# Altium schematic sheet 06-BatteryManagement.SchDoc: Battery Management
size A2; DocumentNumber: 6; SheetNumber: 6; SheetTotal: 15
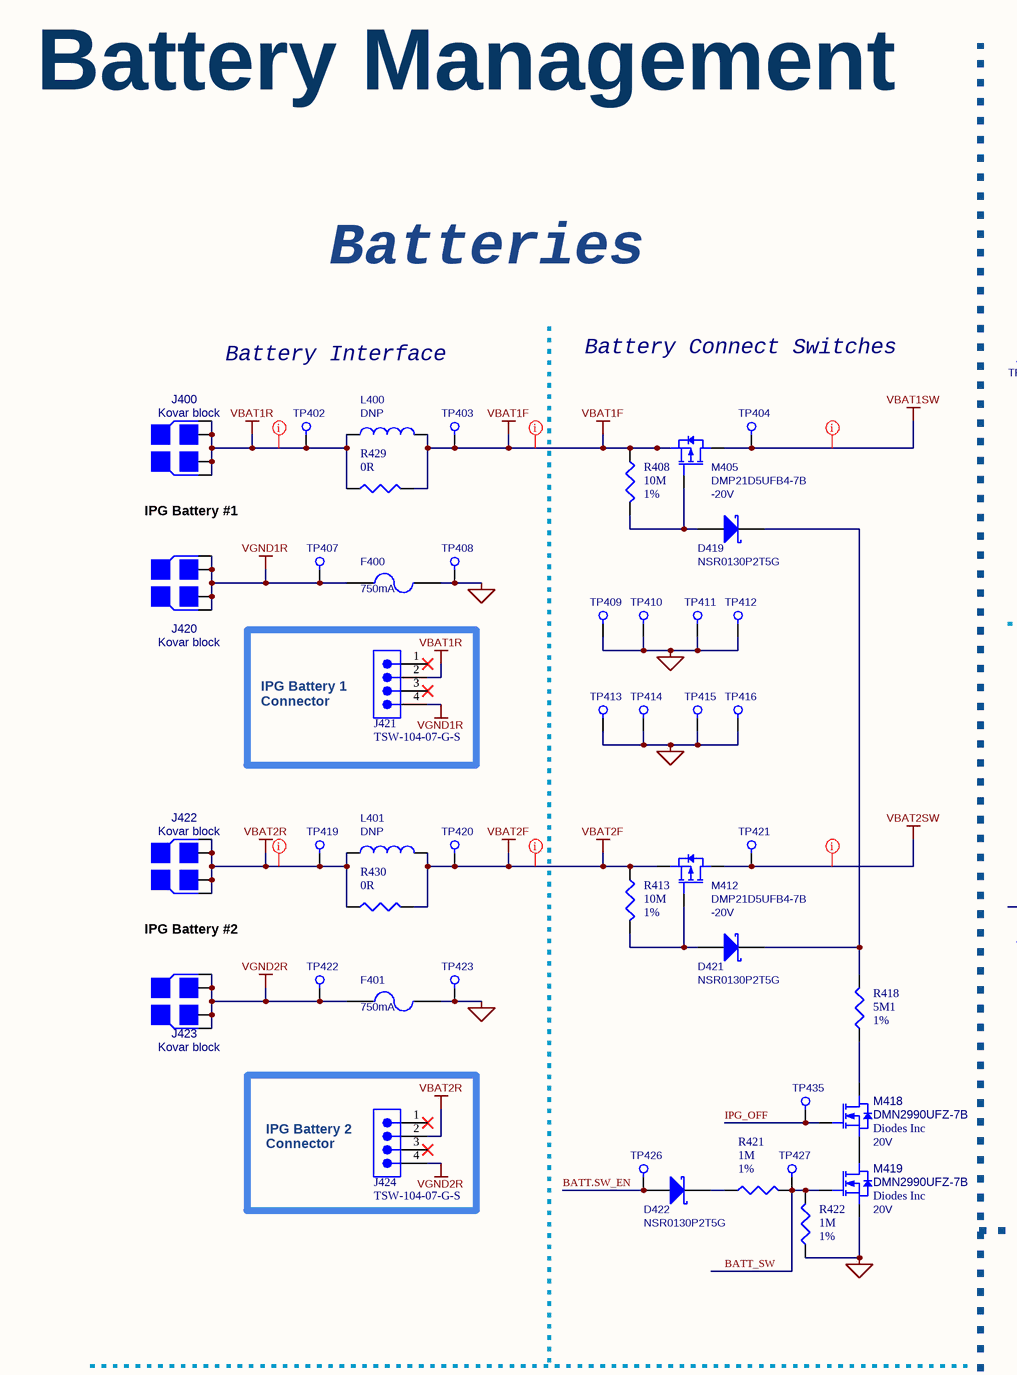
[diagram p0: 06-BatteryManagement.SchDoc, left]
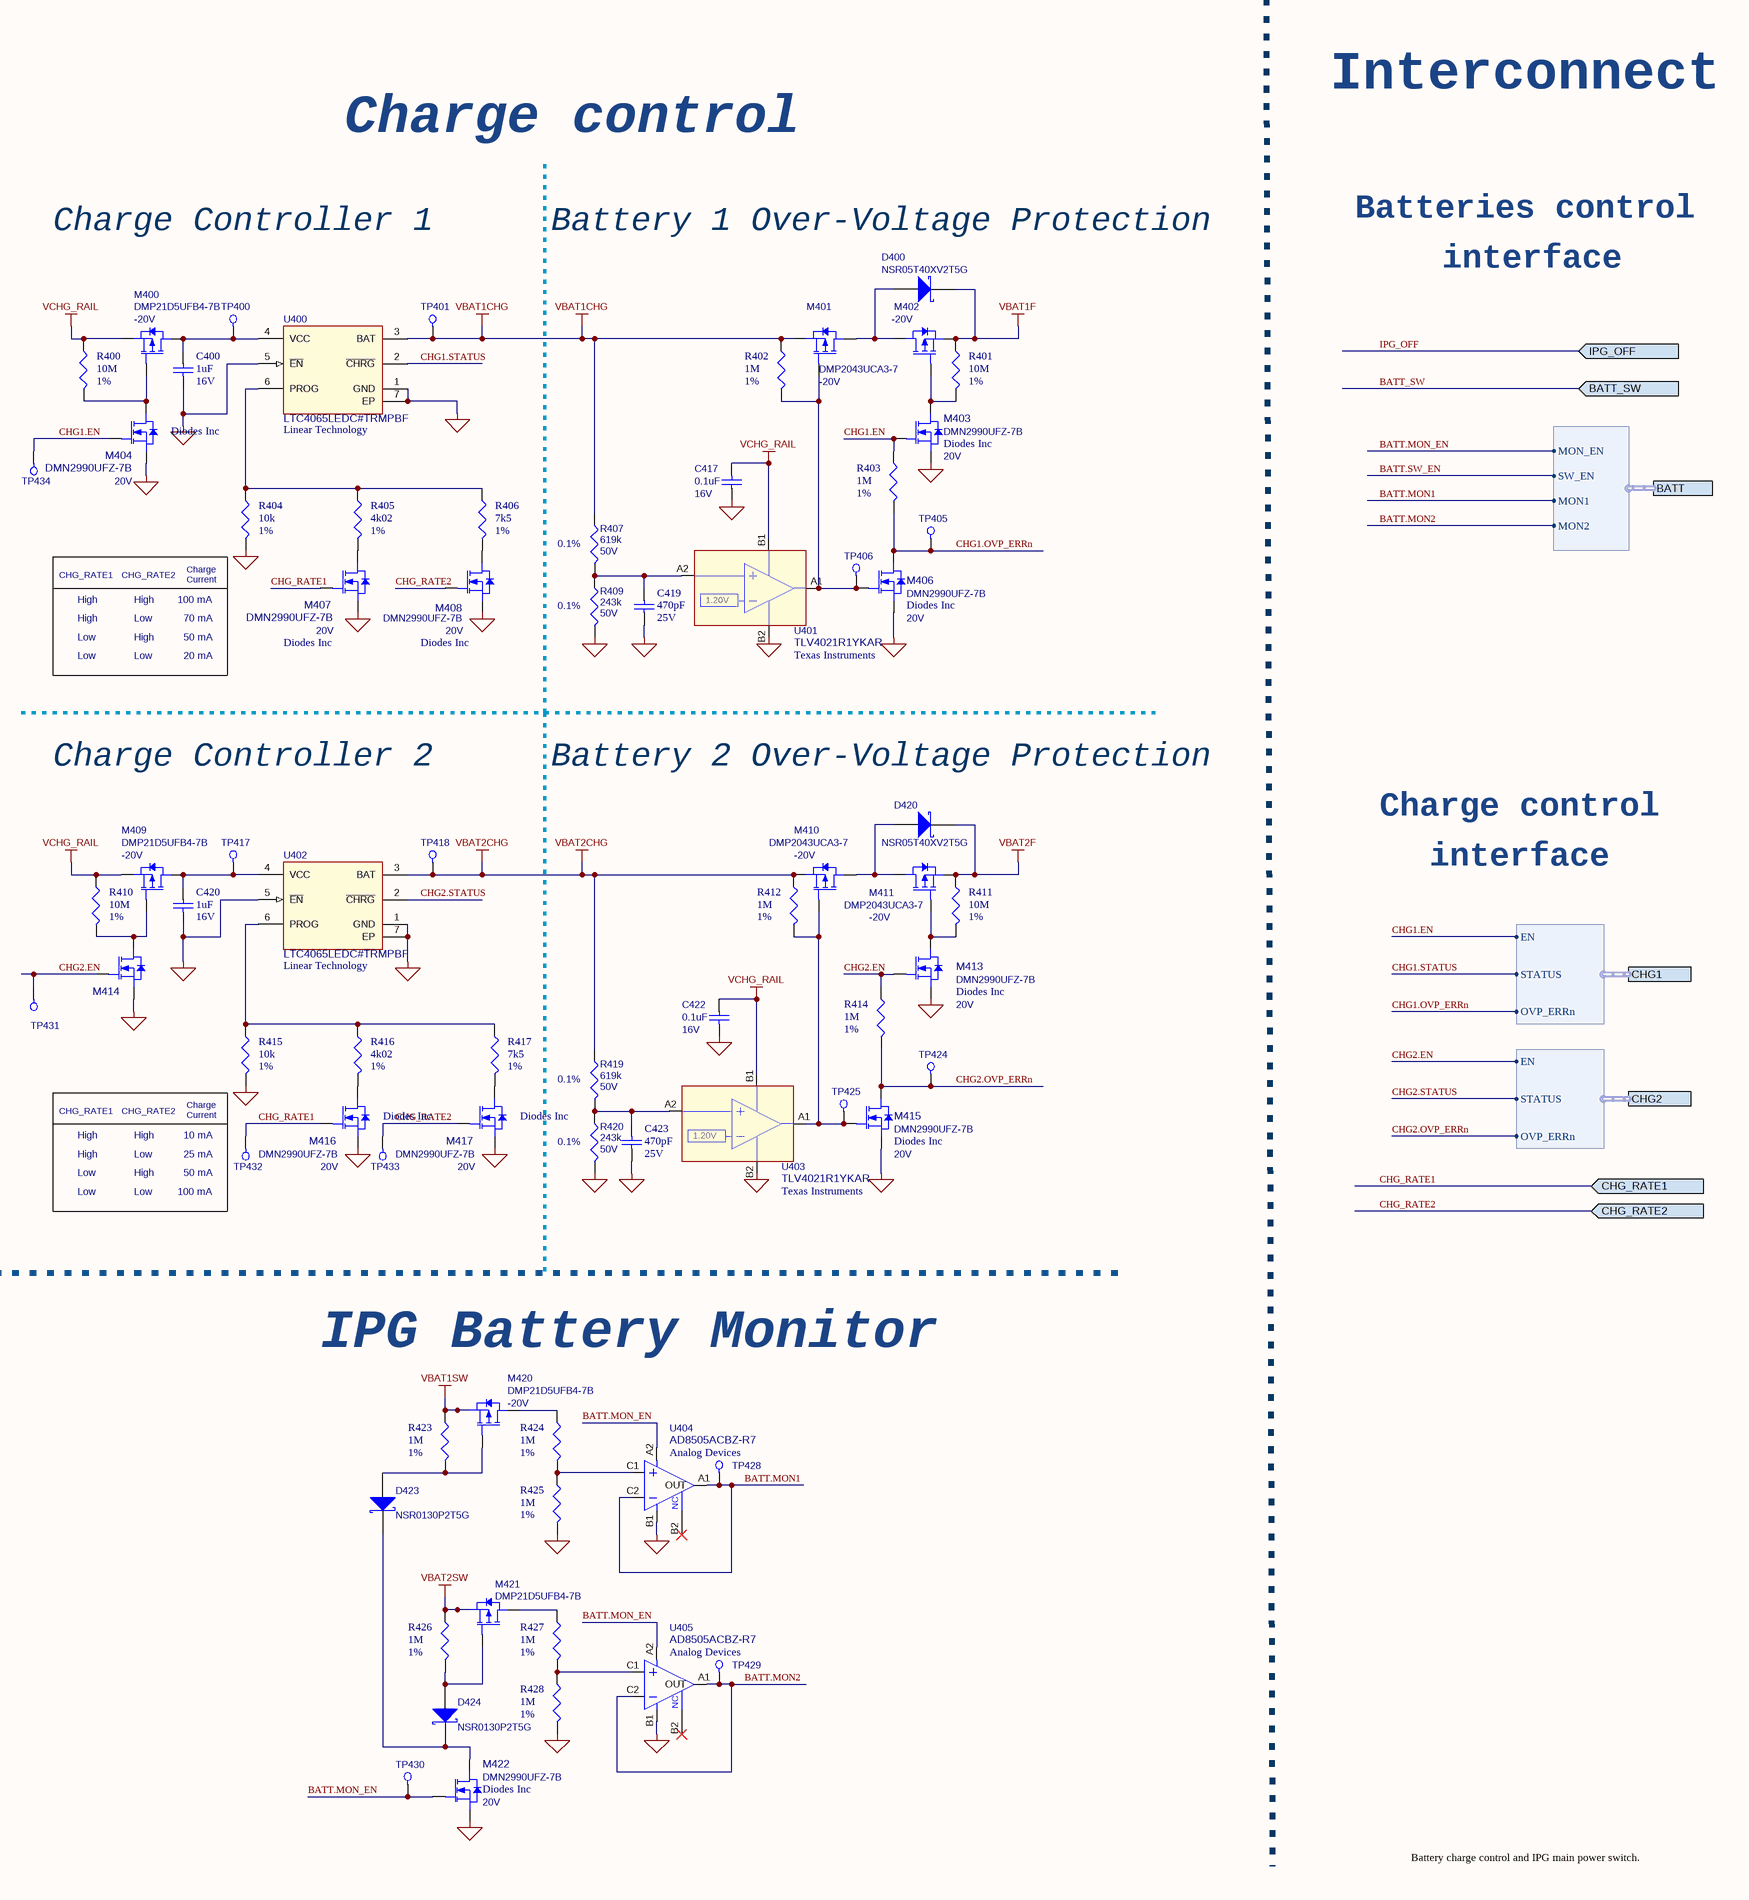
[diagram p1: 06-BatteryManagement.SchDoc, right]

## Parts
C400  value 1uF  Rated DC Voltage (URdc): 16V  [C0201_C]  (hidden comment: GRM033R61C105ME15D)
C417  value 0.1uF  Rating: 16V  [CAP0402_REDUCED]  (hidden comment: GCM155R71C104KA55)
C419  value 470pF  Rated DC Voltage (URdc): 25V  [C0201_C]  (hidden comment: GCM033R71E471KA03D)
C420  value 1uF  Rated DC Voltage (URdc): 16V  [C0201_C]  (hidden comment: GRM033R61C105ME15D)
C422  value 0.1uF  Rating: 16V  [CAP0402_REDUCED]  (hidden comment: GCM155R71C104KA55)
C423  value 470pF  Rated DC Voltage (URdc): 25V  [C0201_C]  (hidden comment: GCM033R71E471KA03D)
D400  NSR05T40XV2T5G  [STM_SOD-523_R]
D419  NSR0130P2T5G  [ONSC_SOD-923_CASE514AB]
D420  NSR05T40XV2T5G  [STM_SOD-523_R]
D421  NSR0130P2T5G  [ONSC_SOD-923_CASE514AB]
D422  NSR0130P2T5G  [ONSC_SOD-923_CASE514AB]
D423  NSR0130P2T5G  [ONSC_SOD-923_CASE514AB]
D424  NSR0130P2T5G  [ONSC_SOD-923_CASE514AB]
F400  value 750mA  [LITTELFUSE_440series_1206_REDUCED]  (hidden comment: 0440.750WR)
F401  value 750mA  [LITTELFUSE_440series_1206_REDUCED]  (hidden comment: 0440.750WR)
J400  Kovar Block  [KOVAR_BLOCK_PAD_1.53MM]  (no BOM)
J420  Kovar Block  [KOVAR_BLOCK_PAD_1.53MM]  (no BOM)
J421  TSW-104-07-G-S  [SMTC-TSW-104-07-X-S]
J422  Kovar Block  [KOVAR_BLOCK_PAD_1.53MM]  (no BOM)
J423  Kovar Block  [KOVAR_BLOCK_PAD_1.53MM]  (no BOM)
J424  TSW-104-07-G-S  [SMTC-TSW-104-07-X-S]
L400  DNP  [L0402_C]
L401  DNP  [L0402_C]
M400  Rating: -20V  [DIODESINC_X2-DFN1006-3_REDUCED]  (hidden comment: DMP21D5UFB4-7B)
M401  Rating: -20V  [DIODESINC_X2-DSN1010-3_CUSTOMPIN]  (hidden comment: DMP2043UCA3-7)
M402  Rating: -20V  [DIODESINC_X2-DSN1010-3_CUSTOMPIN]  (hidden comment: DMP2043UCA3-7)
M403  DMN2990UFZ-7B  Manufacturer: Diodes Inc  Rating: 20V  [DIODESINC_X2-DFN0606-3]
M404  Rating: 20V  Manufacturer: Diodes Inc  [DIODESINC_X2-DFN0606-3]  (hidden comment: DMN2990UFZ-7B)
M405  Rating: -20V  [DIODESINC_X2-DFN1006-3_REDUCED]  (hidden comment: DMP21D5UFB4-7B)
M406  DMN2990UFZ-7B  Manufacturer: Diodes Inc  Rating: 20V  [DIODESINC_X2-DFN0606-3]
M407  Rating: 20V  Manufacturer: Diodes Inc  [DIODESINC_X2-DFN0606-3]  (hidden comment: DMN2990UFZ-7B)
M408  DMN2990UFZ-7B  Rating: 20V  Manufacturer: Diodes Inc  [DIODESINC_X2-DFN0606-3]
M409  Rating: -20V  [DIODESINC_X2-DFN1006-3_REDUCED]  (hidden comment: DMP21D5UFB4-7B)
M410  Rating: -20V  [DIODESINC_X2-DSN1010-3_CUSTOMPIN]  (hidden comment: DMP2043UCA3-7)
M411  Rating: -20V  [DIODESINC_X2-DSN1010-3_CUSTOMPIN]  (hidden comment: DMP2043UCA3-7)
M412  Rating: -20V  [DIODESINC_X2-DFN1006-3_REDUCED]  (hidden comment: DMP21D5UFB4-7B)
M413  DMN2990UFZ-7B  Manufacturer: Diodes Inc  Rating: 20V  [DIODESINC_X2-DFN0606-3]
M414  DMN2990UFZ-7B  [DIODESINC_X2-DFN0606-3]  (value not drawn)
M415  DMN2990UFZ-7B  Manufacturer: Diodes Inc  Rating: 20V  [DIODESINC_X2-DFN0606-3]
M416  DMN2990UFZ-7B  Rating: 20V  Manufacturer: Diodes Inc  [DIODESINC_X2-DFN0606-3]
M417  DMN2990UFZ-7B  Rating: 20V  Manufacturer: Diodes Inc  [DIODESINC_X2-DFN0606-3]
M418  Manufacturer: Diodes Inc  Rating: 20V  [DIODESINC_X2-DFN0606-3]  (hidden comment: DMN2990UFZ-7B)
M419  Manufacturer: Diodes Inc  Rating: 20V  [DIODESINC_X2-DFN0606-3]  (hidden comment: DMN2990UFZ-7B)
M420  Rating: -20V  [DIODESINC_X2-DFN1006-3_REDUCED]  (hidden comment: DMP21D5UFB4-7B)
M421  DMP21D5UFB4-7B  [DIODESINC_X2-DFN1006-3_REDUCED]
M422  DMN2990UFZ-7B  Manufacturer: Diodes Inc  Rating: 20V  [DIODESINC_X2-DFN0606-3]
R400  value 10M  Tolerance: 1%  [R0201_C]  (hidden comment: CRCW020110M0FNED)
R401  value 10M  Tolerance: 1%  [R0201_C]  (hidden comment: CRCW020110M0FNED)
R402  value 1M  Tolerance: 1%  [R0201_C]  (hidden comment: CRCW02011M00FNED)
R403  value 1M  Tolerance: 1%  [R0201_C]  (hidden comment: CRCW02011M00FNED)
R404  value 10k  Tolerance: 1%  [R0201_C]  (hidden comment: CRCW020110K0FNED)
R405  value 4k02  Tolerance: 1%  [R0201_C]  (hidden comment: CRCW02014K02FNED)
R406  value 7k5  Tolerance: 1%  [R0201_C]  (hidden comment: CRCW02017K50FNED)
R407  value 619k  Rating: 50V  Precision: 0.1%  [RES0402_REDUCED]  (hidden comment: MCS0402MD6193BE000)
R408  value 10M  Tolerance: 1%  [R0201_C]  (hidden comment: CRCW020110M0FNED)
R409  value 243k  Rating: 50V  Precision: 0.1%  [RES0402_REDUCED]  (hidden comment: RP73PF1E243KBTD)
R410  value 10M  Tolerance: 1%  [R0201_C]  (hidden comment: CRCW020110M0FNED)
R411  value 10M  Tolerance: 1%  [R0201_C]  (hidden comment: CRCW020110M0FNED)
R412  value 1M  Tolerance: 1%  [R0201_C]  (hidden comment: CRCW02011M00FNED)
R413  value 10M  Tolerance: 1%  [R0201_C]  (hidden comment: CRCW020110M0FNED)
R414  value 1M  Tolerance: 1%  [R0201_C]  (hidden comment: CRCW02011M00FNED)
R415  value 10k  Tolerance: 1%  [R0201_C]  (hidden comment: CRCW020110K0FNED)
R416  value 4k02  Tolerance: 1%  [R0201_C]  (hidden comment: CRCW02014K02FNED)
R417  value 7k5  Tolerance: 1%  [R0201_C]  (hidden comment: CRCW02017K50FNED)
R418  value 5M1  Tolerance: 1%  [R0201_C]  (hidden comment: CRCW02015M10FNED)
R419  value 619k  Rating: 50V  Precision: 0.1%  [RES0402_REDUCED]  (hidden comment: MCS0402MD6193BE000)
R420  value 243k  Rating: 50V  Precision: 0.1%  [RES0402_REDUCED]  (hidden comment: RP73PF1E243KBTD)
R421  value 1M  Tolerance: 1%  [R0201_C]  (hidden comment: CRCW02011M00FNED)
R422  value 1M  Tolerance: 1%  [R0201_C]  (hidden comment: CRCW02011M00FNED)
R423  value 1M  Tolerance: 1%  [R0201_C]  (hidden comment: CRCW02011M00FNED)
R424  value 1M  Tolerance: 1%  [R0201_C]  (hidden comment: CRCW02011M00FNED)
R425  value 1M  Tolerance: 1%  [R0201_C]  (hidden comment: CRCW02011M00FNED)
R426  value 1M  Tolerance: 1%  [R0201_C]  (hidden comment: CRCW02011M00FNED)
R427  value 1M  Tolerance: 1%  [R0201_C]  (hidden comment: CRCW02011M00FNED)
R428  value 1M  Tolerance: 1%  [R0201_C]  (hidden comment: CRCW02011M00FNED)
R429  value 0R  [R0201_C]  (hidden comment: CRCW02010000Z0ED)
R430  value 0R  [R0201_C]  (hidden comment: CRCW02010000Z0ED)
TP400  Test Point  [testpad_0.9mm]  (value not drawn)  (no BOM)
TP401  Test Point  [testpad_0.9mm]  (value not drawn)  (no BOM)
TP402  Test Point  [testpad_0.9mm]  (value not drawn)  (no BOM)
TP403  Test Point  [testpad_0.9mm]  (value not drawn)  (no BOM)
TP404  Test Point  [testpad_0.9mm]  (value not drawn)  (no BOM)
TP405  Test Point  [testpad_0.9mm]  (value not drawn)  (no BOM)
TP406  Test Point  [testpad_0.9mm]  (value not drawn)  (no BOM)
TP407  Test Point  [testpad_0.9mm]  (value not drawn)  (no BOM)
TP408  Test Point  [testpad_0.9mm]  (value not drawn)  (no BOM)
TP409  Test Point  [testpad_0.9mm]  (value not drawn)  (no BOM)
TP410  Test Point  [testpad_0.9mm]  (value not drawn)  (no BOM)
TP411  Test Point  [testpad_0.9mm]  (value not drawn)  (no BOM)
TP412  Test Point  [testpad_0.9mm]  (value not drawn)  (no BOM)
TP413  Test Point  [testpad_0.9mm]  (value not drawn)  (no BOM)
TP414  Test Point  [testpad_0.9mm]  (value not drawn)  (no BOM)
TP415  Test Point  [testpad_0.9mm]  (value not drawn)  (no BOM)
TP416  Test Point  [testpad_0.9mm]  (value not drawn)  (no BOM)
TP417  Test Point  [testpad_0.9mm]  (value not drawn)  (no BOM)
TP418  Test Point  [testpad_0.9mm]  (value not drawn)  (no BOM)
TP419  Test Point  [testpad_0.9mm]  (value not drawn)  (no BOM)
TP420  Test Point  [testpad_0.9mm]  (value not drawn)  (no BOM)
TP421  Test Point  [testpad_0.9mm]  (value not drawn)  (no BOM)
TP422  Test Point  [testpad_0.9mm]  (value not drawn)  (no BOM)
TP423  Test Point  [testpad_0.9mm]  (value not drawn)  (no BOM)
TP424  Test Point  [testpad_0.9mm]  (value not drawn)  (no BOM)
TP425  Test Point  [testpad_0.9mm]  (value not drawn)  (no BOM)
TP426  Test Point  [testpad_0.9mm]  (value not drawn)  (no BOM)
TP427  Test Point  [testpad_0.9mm]  (value not drawn)  (no BOM)
TP428  Test Point  [testpad_0.9mm]  (value not drawn)  (no BOM)
TP429  Test Point  [testpad_0.9mm]  (value not drawn)  (no BOM)
TP430  Test Point  [testpad_0.9mm]  (value not drawn)  (no BOM)
TP431  Test Point  [testpad_0.9mm]  (value not drawn)  (no BOM)
TP432  Test Point  [testpad_0.9mm]  (value not drawn)  (no BOM)
TP433  Test Point  [testpad_0.9mm]  (value not drawn)  (no BOM)
TP434  Test Point  [testpad_0.9mm]  (value not drawn)  (no BOM)
TP435  Test Point  [testpad_0.9mm]  (value not drawn)  (no BOM)
U400  value LTC4065LEDC#TRMPBF  Manufacturer: Linear Technology  [LT_DC6]  (hidden comment: LTC4065LEDC#TRPBF)
U401  Manufacturer: Texas Instruments  [TI_YKA0004]  (hidden comment: TLV4021R1YKAR)
U402  value LTC4065LEDC#TRMPBF  Manufacturer: Linear Technology  [LT_DC6]  (hidden comment: LTC4065LEDC#TRPBF)
U403  Manufacturer: Texas Instruments  [TI_YKA0004]  (hidden comment: TLV4021R1YKAR)
U404  Manufacturer: Analog Devices  [AD8505ACBZ-R7]  (hidden comment: AD8505ACBZ-R7)
U405  Manufacturer: Analog Devices  [AD8505ACBZ-R7]  (hidden comment: AD8505ACBZ-R7)

## Ports
BATT (harness BATT), BATT_SW (in), CHG1 (harness CHG_CTRL), CHG2 (harness CHG_CTRL), CHG_RATE1 (in), CHG_RATE2 (in), IPG_OFF (in)

## Harnesses
CHG_CTRL: STATUS, OVP_ERRn, EN
BATT: MON_EN, SW_EN, MON1, MON2

## Nets
GND: C400.2 C417.1 C419.1 C420.2 C422.1 C423.1 F400.2 F401.2 M403.2(S) M404.2(S) M406.2(S) M407.2(S) M408.2(S) M413.2(S) M414.2(S) M415.2(S) M416.2(S) M417.2(S) M419.2(S) M422.2(S) R404.2 R409.2 R415.2 R420.2 R422.1 R425.2 R428.2 TP408.1 TP409.1 TP410.1 TP411.1 TP412.1 TP413.1 TP414.1 TP415.1 TP416.1 TP423.1 U400.1(GND) U400.5(~{EN}) U400.7(EP) U401.B2(V-) U402.1(GND) U402.5(~{EN}) U402.7(EP) U403.B2(V-) U404.B1(V-) U405.B1(V-)
VBAT1CHG: M401.3(S) R402.1 R407.1 TP401.1 U400.3(BAT)
VBAT1F: D400.1(K) L400.2 M402.3(S) M405.2(S) R401.1 R408.1 R429.2 TP403.1
VBAT1R: J400.1 J400.2 J400.3 J400.4 J421.2 L400.1 R429.1 TP402.1
VBAT1SW: M405.3(D) M420.2(S) R423.1 TP404.1
VBAT2CHG: M410.3(S) R412.1 R419.1 TP418.1 U402.3(BAT)
VBAT2F: D420.1(K) L401.2 M411.3(S) M412.2(S) R411.1 R413.1 R430.2 TP420.1
VBAT2R: J422.1 J422.2 J422.3 J422.4 J424.2 L401.1 R430.1 TP419.1
VBAT2SW: M412.3(D) M421.2(S) R426.1 TP421.1
VCHG_RAIL: C417.2 C422.2 M400.2(S) M409.2(S) R400.1 R410.1 U401.B1(V+) U403.B1(V+)
VGND1R: F400.1 J420.1 J420.2 J420.3 J420.4 J421.4 TP407.1
VGND2R: F401.1 J423.1 J423.2 J423.3 J423.4 J424.4 TP422.1
BATT.MON1: TP428.1 U404.A1(OUT) U404.C2(IN-) ; port BATT.MON1
BATT.MON2: TP429.1 U405.A1(OUT) U405.C2(IN-) ; port BATT.MON2
BATT.MON_EN: M422.1(G) TP430.1 U404.A2(V+) U405.A2(V+) ; port BATT.MON_EN
BATT.SW_EN: D422.2(A) TP426.1 ; port BATT.SW_EN
BATT_SW: M419.1(G) R421.2 R422.2 TP427.1 ; port BATT_SW
CHG1.EN: M403.1(G) M404.1(G) R403.1 TP434.1 ; port CHG1.EN
CHG1.OVP_ERRn: M406.3(D) R403.2 TP405.1 ; port CHG1.OVP_ERRn
CHG1.STATUS: U400.2(~{CHRG}) ; port CHG1.STATUS
CHG2.EN: M413.1(G) M414.1(G) R414.1 TP431.1 ; port CHG2.EN
CHG2.OVP_ERRn: M415.3(D) R414.2 TP424.1 ; port CHG2.OVP_ERRn
CHG2.STATUS: U402.2(~{CHRG}) ; port CHG2.STATUS
CHG_RATE1: M407.1(G) M416.1(G) TP432.1 ; port CHG_RATE1
CHG_RATE2: M408.1(G) M417.1(G) TP433.1 ; port CHG_RATE2
IPG_OFF: M418.1(G) TP435.1 ; port IPG_OFF
NetC400_1: C400.1 M400.3(D) TP400.1 U400.4(VCC)
NetC419_2: C419.2 R407.2 R409.1 U401.A2(IN)
NetC420_1: C420.1 M409.3(D) TP417.1 U402.4(VCC)
NetC423_2: C423.2 R419.2 R420.1 U403.A2(IN)
NetD400_2: D400.2(A) M401.1(D) M402.1(D)
NetD419_1: D419.1(K) D421.1(K) R418.2
NetD419_2: D419.2(A) M405.1(G) R408.2
NetD420_2: D420.2(A) M410.1(D) M411.1(D)
NetD421_2: D421.2(A) M412.1(G) R413.2
NetD422_1: D422.1(K) R421.1
NetD423_1: D423.1(K) D424.1(K) M422.3(D)
NetD423_2: D423.2(A) M420.1(G) R423.2
NetD424_2: D424.2(A) M421.1(G) R426.2
NetM400_1: M400.1(G) M404.3(D) R400.2
NetM401_2: M401.2(G) M406.1(G) R402.2 TP406.1 U401.A1(OUT)
NetM402_2: M402.2(G) M403.3(D) R401.2
NetM407_3: M407.3(D) R405.2
NetM408_3: M408.3(D) R406.2
NetM409_1: M409.1(G) M414.3(D) R410.2
NetM410_2: M410.2(G) M415.1(G) R412.2 TP425.1 U403.A1(OUT)
NetM411_2: M411.2(G) M413.3(D) R411.2
NetM416_3: M416.3(D) R416.2
NetM417_3: M417.3(D) R417.2
NetM418_2: M418.2(S) M419.3(D)
NetM418_3: M418.3(D) R418.1
NetM420_3: M420.3(D) R424.1
NetM421_3: M421.3(D) R427.1
NetR404_1: R404.1 R405.1 R406.1 U400.6(PROG)
NetR415_1: R415.1 R416.1 R417.1 U402.6(PROG)
NetR424_2: R424.2 R425.1 U404.C1(IN+)
NetR427_2: R427.2 R428.1 U405.C1(IN+)

Not connected (* = marked no-connect by the designer): J421 1* 3*; J424 1* 3*; U404 B2(NC)*; U405 B2(NC)*

## Layout directives
Voltage: 2.8-4.2V; net class POWER: VBAT1F, VBAT1R, VBAT1SW, VBAT2F, VBAT2R, VBAT2SW

## Notes on the sheet
- Interconnect
- Charge control
- Battery Management
- Charge Controller 1
- Battery 1 Over-Voltage Protection
- Batteries control
- interface
- Batteries
- Battery Interface
- Battery Connect Switches
- IPG Battery #1
  Connections
- CHG_RATE1
- High
- CHG_RATE2
- Low
- (near R404) Charge
  Current
- 100 mA
- 70 mA
- 50 mA
- 20 mA
- (near J421) IPG Battery 1
  Connector
- Charge Controller 2
- Battery 2 Over-Voltage Protection
- IPG Battery #2
  Connections
- Charge
  Current
- (near TP432) 10 mA
- (near TP432) 25 mA
- (near TP432) 50 mA
- (near J424) IPG Battery 2
  Connector
- IPG Battery Monitor
- Battery charge control and IPG main power switch.
- Project:
- Schematic:
- Design by:
- Date:
- Ver:
- .
- Comments:
- Reviewed by:
- (in symbol TLV4021R1YKAR) 1.20V

## Library data of the parts
C400 C420 = GRM033R61C105ME15D: Ceramic Capacitor, Multilayer, Ceramic, 16V, 20% +Tol, 20% -Tol, X5R, 15% TC, 1uF, Surface Mount, 0201; Manufacturer: Murata; Category: Ceramic Capacitors; Supplier: Digikey; Supplier Part Number: 490-18654-1-ND; Manufacturer Part Number: GRM033R61C105ME15D; RoHS: No; Stock: 132893; Pricing: 1=0,16, 10=0,105, 50=0,0628, 100=0,0493, 500=0,03644, 1000=0,03017, 2500=0,02808, 5000=0,02569 (USD); Supplier 1: Avnet; Supplier Part Number 1: GRM033R61C105ME15D
C417 C422 = GCM155R71C104KA55: Capacitor, 0.1uF, X7R, 16V, 10%, 0402, Implant-grade; Manufacturer: Murata; Medical Grade MFR PN: GCH155R71C104KE01; Length (mm): 1.00 ±0.05; Medical Grade MFR: Murata; PCB Footprint: cap0402_reduced; Thickness (mm): 0.50 ±0.05; Width (mm): 0.50 ±0.05; Category: Capacitor; Supplier 1: Arrow Electronics; Supplier Part Number 1: GCM155R71C104KA55J; Check: *; Package Description: 0402; Status: *; Review: *; Manufacturer Part Number: GCM155R71C104KA55
C419 C423 = GCM033R71E471KA03D: Ceramic Capacitor, Multilayer, Ceramic, 25V, 10% +Tol, 10% -Tol, X7R, 15% TC, 0.00047uF, Surface Mount, 0201; Manufacturer: Murata; Multilayer: Yes; Reference Standard: AEC-Q200; Category: Ceramic Capacitors; Supplier: Digikey; Supplier Part Number: 490-17744-1-ND; Manufacturer Part Number: GCM033R71E471KA03D; RoHS: Yes; Stock: 21174; Pricing: 1=0,1, 10=0,028, 50=0,016, 100=0,0125, 500=0,00938, 1000=0,00736, 2500=0,0067, 5000=0,00616 (USD); Mounting Technology: Surface Mount; Pins: 2; Dielectric Material: Ceramic; Package Shape: Rectangular; Case/Package: 0201; Terminal Finish: Nickel; Min Operating Temperature: -55°C; Max Operating Temperature: 125°C; JESD-609 Code: e3; Capacitor Type: Ceramic; Tolerance  (fill in as +-): 10%; Package Style: SMTMeter; Packaging: Tape and Reel; Tolerance (fill in as +-): 10%; Temperature Characteristics Code: X7R; Termination: Wraparound; Length: 0.6mm; Width: 0.3mm; Height: 0.33mm; Reach SVHC Compliant: Yes; RoHS Compliant: Yes; ComponentLink1URL: https://psearch.en.murata.com:443/capacitor/product/GCM033R71E471KA03%23.pdf?src-supplier=IHS+Markit; ComponentLink1Description: https://psearch.en.murata.com:443/capacitor/product/GCM033R71E471KA03%23.pdf?src-supplier=IHS+Markit; ComponentLink2URL: https://datasheet.ciiva.com/11604/product-11604532.pdf?src-supplier=Avnet; ComponentLink2Description: https://datasheet.ciiva.com/11604/product-11604532.pdf?src-supplier=Avnet; ComponentLink3URL: https://datasheet.ciiva.com/163/s0717e-163390.pdf?src-supplier=Digikey; ComponentLink3Description: https://datasheet.ciiva.com/163/s0717e-163390.pdf?src-supplier=Digikey; Supplier 1: Arrow Electronics; Supplier Part Number 1: GCM033R71E471KA03D
D400 D420 = NSR05T40XV2T5G: Schottky, 40V, 500mA, 530mV, SOD-523; Manufacturer: ON Semiconductor; Medical Grade MFR: TBD; Review: 020823; Length (mm): 1.60 ±0.10; Medical Grade MFR PN: TBD; PCB Footprint: TBD; Rating: 40V, 500mA; Thickness (mm): 0.60 ±0.10; Value: NSR05T40XV2T5G; Width (mm): 0.80 ±0.10; Category: Diode; Supplier 1: Arrow Electronics; Supplier Part Number 1: NSR05T40XV2T5G; Status: Approved; Manufacturer Part Number: NSR05T40XV2T5G
D419 D421-D424 = NSR0130P2T5G: Schottky, 30V, 100mA, 385mV, 200mW, SOD-923; Manufacturer: ON Semiconductor; Medical Grade MFR: TBD; Review: 020823; Length (mm): 1.00 ±0.05; Medical Grade MFR PN: TBD; PCB Footprint: TBD; Rating: 30V; Thickness (mm): 0.40 ±0.03; Value: NSR0130P2T5G; Width (mm): 0.60 ±0.05; Category: Diode; Supplier 1: Future Electronics; Supplier Part Number 1: 7098145; Status: Approved; Manufacturer Part Number: NSR0130P2T5G
F400 F401 = 0440.750WR: Fuse, 750mA, 63V, 1206; Manufacturer: Littelfuse; Medical Grade MFR PN: 0440.750WRA; PCB Footprint: fuse1206_reduced; Review: 020823; Length (mm): 3.20 ±0.18; Medical Grade MFR: Littelfuse; Rating: 750mA; Thickness (mm): 0.84 ±0.01; Width (mm): 1.63 ±0.10; Category: Fuse; Supplier 1: Digi-Key; Supplier Part Number 1: F1603CT-ND; Status: Approved; Manufacturer Part Number: 0440.750WR
J400 J420 J422 J423 = Kovar Block: Kovar block, TBD; Manufacturer: TBD; Manufacturer PN: TBD; Medical Grade MFR: N/A; Medical Grade MFR PN: N/A; PCB Footprint: TBD; Rating: N/A; Value: Kovar block; Category: Kovar block; Length (mm): TBD; Thickness (mm): TBD; Width (mm): TBD; Status: *; Review: *
J421 J424 = TSW-104-07-G-S: Board Connector, 4 Contact(s), 1 Row(s), Male, Straight, 0.1 inch Pitch, Solder Terminal, Black Insulator, Receptacle; Manufacturer: Samtec; PartNumber: TSW-106-07-G-S; Pitch: 2.54 mm; Option: General Purpose; Filter Feature: No; Number of Rows Loaded: 1; Number of Contacts: 4; Additional Feature: E.L.P.; Contact Pattern: RECTANGULAR; Contact Style: SQ PIN-SKT; Mating Information: MULTIPLE MATING PARTS AVAILABLE; Plating Thickness: 10uin; Reference Standard: UL; Reliability: COMMERCIAL; RoHS: True; ComponentLink1Description: Manufacturer URL; DatasheetVersion: F-214; Orientation: Vertical; ComponentLink1URL: http://www.samtec.com; ComponentLink3Description: Package Specification; ComponentLink2Description: Datasheet; PackageVersion: DM, 8/1988; PackageDescription: .025[0.64] SQ. Post Terminal Strip Assembly; PackageReference: TSW-106-07-X-S; Mounting Technology: Through-hole; Temperature Range: -55 to 125 degC; ComponentLink3URL: http://www.samtec.com/documents/webfiles/cpdf/TSW-XXX-XX-XXX-X-XX-XXX-MKT.pdf; ComponentLink2URL: http://www.samtec.com/documents/webfiles/pdf/TSW_TH.PDF; Supplier: Arrow Electronics; Supplier Part Number: TSW-104-07-G-S; Manufacturer Part Number: TSW-104-07-G-S; Category: Board to Board Connectors; Stock: 5100; Pricing: 1=0,59, 50=0,46, 100=0,37, 500=0,32, 1000=0,24, 2000=0,21, 5000=0,15 (USD); Contact Finish - Termination: Gold (Au) - with Nickel (Ni) barrier; Contact Material: Bronze; Contact Finish - Mating: GOLD (10) OVER NICKEL (50); Insulation Color: Black; Insulation Material: Glass; Connector Type: BOARD CONNECTOR; JESD-609 Code: e4; Contact Gender: Male; Mixed Contacts: No; Mounting Style: STRAIGHT; Termination: Solder; Number Of Connectors: 1; Number Of PCB Rows: 1; PCB Contact Pattern: RECTANGULAR; Body/Shell Style: RECEPTACLE; Terminal Pitch: 2.54mm; Mating Contact Pitch: 0.1inch; Body Breadth: 0.1inch; Body Depth: 0.1inch; Terminal Length: 0.1inch; Flammability Rating: UL94 V-0; DIN Conformance: No; IEC Conformance: No; MIL Conformance: No; Reach SVHC Compliant: Yes; RoHS Compliant: Yes; ComponentLink4URL: https://datasheet.ciiva.com:443/pdfs/VipMasterIC/IC/SAMI/SAMI-S-A0003531373/SAMI-S-A0003531373-1.pdf?src-supplier=IHS+Markit; ComponentLink4Description: https://datasheet.ciiva.com:443/pdfs/VipMasterIC/IC/SAMI/SAMI-S-A0003531373/SAMI-S-A0003531373-1.pdf?src-supplier=IHS+Markit; ComponentLink5URL: https://datasheet.ciiva.com/6889/tsw-xxx-xx-xxx-x-xx-xxx-mkt-6889291.pdf?src-supplier=Digi-Key; ComponentLink5Description: https://datasheet.ciiva.com/6889/tsw-xxx-xx-xxx-x-xx-xxx-mkt-6889291.pdf?src-supplier=Digi-Key; Supplier 1: Digikey; Supplier Part Number 1: SAM1029-04-ND
L400 L401 = IND_DNP_0402: DNP: Inductor, DNP, 0402; PCB Footprint: ind0402_reduced; Review: 020823; Value: DNP; Length (mm): 1.11; Manufacturer: N/A; Manufacturer PN: N/A; Medical Grade MFR: N/A; Medical Grade MFR PN: N/A; Rating: N/A; Thickness (mm): 0.65; Width (mm): 0.66; Category: Inductor; Package Description: 0402; Status: Approved
M400 M405 M409 M412 M420 M421 = DMP21D5UFB4-7B: MOSFET, P-chan, -20V, -400mA, X2-DFN1006-3; Manufacturer: Diodes Inc; Medical Grade MFR: TBD; Review: 020823; Category: Transistor; Length (mm): 1.00 ±0.05; Medical Grade MFR PN: TBD; Thickness (mm): 0.40; Width (mm): 0.60 ±0.05; Value: DMP21D5UFB4-7B; Supplier 1: Digi-Key; Supplier Part Number 1: DMP21D5UFB4-7BDICT-ND; Status: Approved; Manufacturer Part Number: DMP21D5UFB4-7B
  M421: Rating: -20V
M401 M402 M410 M411 = DMP2043UCA3-7: MOSFET, P-chan, -20V, -3.4A, DFN1010-3; Manufacturer: Diodes Inc; Medical Grade MFR: TBD; Category: Transistor; Length (mm): 0.96 ±0.04; Medical Grade MFR PN: TBD; PCB Footprint: TBD; Thickness (mm): 0.32 ±0.03; Value: DMP2043UCA3-7; Width (mm): 0.96 ±0.04; Supplier 1: Digi-Key; Supplier Part Number 1: 31-DMP2043UCA3-7CT-ND; Status: *; Review: *; Manufacturer Part Number: DMP2043UCA3-7
M403 M404 M406-M408 M413 M415-M419 M422 = DMN2990UFZ-7B: MOSFET, N-Chan, 20V, 170mA, DFN0606; Medical Grade MFR: TBD; Review: 020823; Category: Transistor; Length (mm): 0.62 ±0.05; Medical Grade MFR PN: TBD; PCB Footprint: TBD; Thickness (mm): 0.38 ±0.02; Value: DMN2990UFZ-7B; Width (mm): 0.62 ±0.05; Supplier 1: Digi-Key; Supplier Part Number 1: DMN2990UFZ-7BDICT-ND; Status: Approved; Manufacturer Part Number: DMN2990UFZ-7B
M414 = DMN2990UFZ-7B: MOSFET, N-Chan, 20V, 170mA, DFN0606; Manufacturer: Diodes Inc; Medical Grade MFR: TBD; Review: 020823; Category: Transistor; Length (mm): 0.62 ±0.05; Medical Grade MFR PN: TBD; PCB Footprint: TBD; Rating: 20V; Thickness (mm): 0.38 ±0.02; Value: DMN2990UFZ-7B; Width (mm): 0.62 ±0.05; Supplier 1: Digi-Key; Supplier Part Number 1: DMN2990UFZ-7BDICT-ND; Status: Approved; Manufacturer Part Number: DMN2990UFZ-7B
R400 R401 R408 R410 R411 R413 = CRCW020110M0FNED: Fixed Resistor, Metal Glaze/thick Film, 0.05W, 10000000ohm, 30V, 1% +/-Tol, 200ppm/Cel, Surface Mount, 0201; Manufacturer: Vishay Draloric; Medical Grade MFR: Mini-Systems; Medical Grade MFR PN: MWA96SM-1005F-NS62TR; Power: 50mW; Rated Temperature: 70°C; Temperature Coefficient: 200ppm/°C; Category: Chip SMD Resistors; Supplier: Mouser; Supplier Part Number: 71-CRCW020110M0FNED; Manufacturer Part Number: CRCW020110M0FNED; RoHS: Yes; Stock: 159754; Pricing: 1=0,1, 10=0,024, 50=0,024, 100=0,014, 1000=0,011, 10000=0,006 (USD); Mounting Technology: Surface Mount; Pins: 2; Package Shape: Rectangular; Case/Package: 0201; Terminal Finish: Nickel; Min Operating Temperature: -55°C; Max Operating Temperature: 155°C; JESD-609 Code: e3; Resistor Type: FIXED RESISTOR; Packaging: Tape and Reel; Technology: METAL GLAZE/THICK FILM; Termination: Wraparound; Working Voltage: 30V; Reach SVHC Compliant: Yes; RoHS Compliant: Yes; ComponentLink1URL: https://datasheet.ciiva.com:443/pdfs/VipMasterIC/IC/VISH/VISH-S-A0002932828/VISH-S-A0002932828-1.pdf?src-supplier=IHS+Markit; ComponentLink1Description: https://datasheet.ciiva.com:443/pdfs/VipMasterIC/IC/VISH/VISH-S-A0002932828/VISH-S-A0002932828-1.pdf?src-supplier=IHS+Markit; ComponentLink2URL: https://datasheet.ciiva.com/7673/1719906-7673177.pdf?src-supplier=Element14; ComponentLink2Description: https://datasheet.ciiva.com/7673/1719906-7673177.pdf?src-supplier=Element14; ComponentLink3URL: https://datasheet.ciiva.com/7673/1719906-7673178.pdf?src-supplier=Element14; ComponentLink3Description: https://datasheet.ciiva.com/7673/1719906-7673178.pdf?src-supplier=Element14; ComponentLink4URL: https://datasheet.ciiva.com/22692/1719906-22692711.pdf?src-supplier=Element14; ComponentLink4Description: https://datasheet.ciiva.com/22692/1719906-22692711.pdf?src-supplier=Element14; ComponentLink5URL: https://datasheet.ciiva.com/22665/1700795-22665701.pdf?src-supplier=Element14; ComponentLink5Description: https://datasheet.ciiva.com/22665/1700795-22665701.pdf?src-supplier=Element14; Supplier 1: Digikey; Supplier Part Number 1: 541-CRCW020110M0FNEDCT-ND
R402 R403 R412 R414 R421-R428 = CRCW02011M00FNED: Fixed Resistor, Metal Glaze/thick Film, 0.05W, 1000000ohm, 30V, 1% +/-Tol, 200ppm/Cel, Surface Mount, 0201; Manufacturer: Vishay; Medical Grade MFR: Mini-Systems; Medical Grade MFR PN: MWA96SM-1004F-NS62TR; Power: 50mW; Rated Temperature: 70°C; Temperature Coefficient: 200ppm/°C; Package Height: 0.23mm; Package Length: 0.6mm; Package Width: 0.3mm; Reference Standard: AEC-Q200; Category: Chip SMD Resistors; Supplier: Digikey; Supplier Part Number: 541-1.00MABCT-ND; Manufacturer Part Number: CRCW02011M00FNED; RoHS: Yes; Stock: 392914; Pricing: 1=0,1, 10=0,037, 50=0,0242, 100=0,0204, 500=0,01426, 1000=0,01241, 5000=0,00924 (USD); Mounting Technology: Surface Mount; Pins: 2; Package Shape: Rectangular; Case/Package: 0201; Terminal Finish: Nickel; Min Operating Temperature: -55°C; Max Operating Temperature: 155°C; JESD-609 Code: e3; Resistor Type: FIXED RESISTOR; Construction: Chip; Package Style: SMTMeter; Packaging: Tape and Reel; Technology: METAL GLAZE/THICK FILM; Termination: Wraparound; Working Voltage: 30V; Reach SVHC Compliant: Yes; RoHS Compliant: Yes; ComponentLink1URL: https://datasheet.ciiva.com:443/pdfs/VipMasterIC/IC/VISH/VISH-S-A0002932828/VISH-S-A0002932828-1.pdf?src-supplier=IHS+Markit; ComponentLink1Description: https://datasheet.ciiva.com:443/pdfs/VipMasterIC/IC/VISH/VISH-S-A0002932828/VISH-S-A0002932828-1.pdf?src-supplier=IHS+Markit; ComponentLink2URL: https://datasheet.ciiva.com/7841/1719906-7841438.pdf?src-supplier=Element14; ComponentLink2Description: https://datasheet.ciiva.com/7841/1719906-7841438.pdf?src-supplier=Element14; ComponentLink3URL: https://datasheet.ciiva.com/7841/1719906-7841439.pdf?src-supplier=Element14; ComponentLink3Description: https://datasheet.ciiva.com/7841/1719906-7841439.pdf?src-supplier=Element14; ComponentLink4URL: https://datasheet.ciiva.com/7859/dcrcwe3-7859689.pdf?src-supplier=Element14; ComponentLink4Description: https://datasheet.ciiva.com/7859/dcrcwe3-7859689.pdf?src-supplier=Element14; ComponentLink5URL: https://datasheet.ciiva.com/16757/70202042-16757675.pdf?src-supplier=Allied+Electronics; ComponentLink5Description: https://datasheet.ciiva.com/16757/70202042-16757675.pdf?src-supplier=Allied+Electronics; ComponentLink6URL: https://datasheet.ciiva.com/22692/1719906-22692761.pdf?src-supplier=Element14; ComponentLink6Description: https://datasheet.ciiva.com/22692/1719906-22692761.pdf?src-supplier=Element14; ComponentLink7URL: https://datasheet.ciiva.com/9109/crcw0201e3-9109910.pdf?src-supplier=Avnet; ComponentLink7Description: https://datasheet.ciiva.com/9109/crcw0201e3-9109910.pdf?src-supplier=Avnet; ComponentLink8URL: https://datasheet.ciiva.com/22675/1847332-22675065.pdf?src-supplier=Element14; ComponentLink8Description: https://datasheet.ciiva.com/22675/1847332-22675065.pdf?src-supplier=Element14; ComponentLink9URL: https://datasheet.ciiva.com/2474/crcw0201e3-2474824.pdf?src-supplier=Digikey; ComponentLink9Description: https://datasheet.ciiva.com/2474/crcw0201e3-2474824.pdf?src-supplier=Digikey; ComponentLink10URL: https://datasheet.ciiva.com/2474/crcw0201e3-2474825.pdf?src-supplier=Digikey; ComponentLink10Description: https://datasheet.ciiva.com/2474/crcw0201e3-2474825.pdf?src-supplier=Digikey; ComponentLink11URL: https://datasheet.ciiva.com/2474/crcw0201e3-2474826.pdf?src-supplier=Digikey; ComponentLink11Description: https://datasheet.ciiva.com/2474/crcw0201e3-2474826.pdf?src-supplier=Digikey; Supplier 1: Digikey; Supplier Part Number 1: 541-1.00MABCT-ND
R404 R415 = CRCW020110K0FNED: Fixed Resistor, Metal Glaze/thick Film, 0.05W, 10000ohm, 30V, 1% +/-Tol, 200ppm/Cel, Surface Mount, 0201; Manufacturer: Vishay; Medical Grade MFR: Mini-Systems; Medical Grade MFR PN: MWA96SM-1002F-NS62TR; Power: 50mW; Rated Temperature: 70°C; Temperature Coefficient: 200ppm/°C; Package Height: 0.23mm; Package Length: 0.6mm; Package Width: 0.3mm; Reference Standard: AEC-Q200; Category: Chip SMD Resistors; Supplier: Digikey; Supplier Part Number: 541-10.0KABCT-ND; Manufacturer Part Number: CRCW020110K0FNED; RoHS: Yes; Stock: 1011530; Pricing: 1=0,1, 10=0,037, 50=0,0242, 100=0,0204, 500=0,01426, 1000=0,01241, 5000=0,00924 (USD); Mounting Technology: Surface Mount; Pins: 2; Package Shape: Rectangular; Case/Package: 0201; Terminal Finish: Nickel; Min Operating Temperature: -55°C; Max Operating Temperature: 155°C; JESD-609 Code: e3; Resistor Type: FIXED RESISTOR; Construction: Chip; Package Style: SMTMeter; Packaging: Tape and Reel; Technology: METAL GLAZE/THICK FILM; Termination: Wraparound; Working Voltage: 30V; Reach SVHC Compliant: Yes; RoHS Compliant: Yes; ComponentLink1URL: https://datasheet.ciiva.com:443/pdfs/VipMasterIC/IC/VISH/VISH-S-A0002932828/VISH-S-A0002932828-1.pdf?src-supplier=IHS+Markit; ComponentLink1Description: https://datasheet.ciiva.com:443/pdfs/VipMasterIC/IC/VISH/VISH-S-A0002932828/VISH-S-A0002932828-1.pdf?src-supplier=IHS+Markit; ComponentLink2URL: https://datasheet.ciiva.com/2474/crcw0201e3-2474819.pdf?src-supplier=Digikey; ComponentLink2Description: https://datasheet.ciiva.com/2474/crcw0201e3-2474819.pdf?src-supplier=Digikey; ComponentLink3URL: https://datasheet.ciiva.com/2474/crcw0201e3-2474820.pdf?src-supplier=Digikey; ComponentLink3Description: https://datasheet.ciiva.com/2474/crcw0201e3-2474820.pdf?src-supplier=Digikey; ComponentLink4URL: https://datasheet.ciiva.com/2474/crcw0201e3-2474818.pdf?src-supplier=Digikey; ComponentLink4Description: https://datasheet.ciiva.com/2474/crcw0201e3-2474818.pdf?src-supplier=Digikey; ComponentLink5URL: https://datasheet.ciiva.com/16436/dcrcwe3-16436222.pdf?src-supplier=Future+Electronics; ComponentLink5Description: https://datasheet.ciiva.com/16436/dcrcwe3-16436222.pdf?src-supplier=Future+Electronics; ComponentLink6URL: https://datasheet.ciiva.com/7983/1719906-7983320.pdf?src-supplier=Element14; ComponentLink6Description: https://datasheet.ciiva.com/7983/1719906-7983320.pdf?src-supplier=Element14; ComponentLink7URL: https://datasheet.ciiva.com/7983/1719906-7983319.pdf?src-supplier=Element14; ComponentLink7Description: https://datasheet.ciiva.com/7983/1719906-7983319.pdf?src-supplier=Element14; ComponentLink8URL: https://datasheet.ciiva.com/22692/1719906-22692709.pdf?src-supplier=Element14; ComponentLink8Description: https://datasheet.ciiva.com/22692/1719906-22692709.pdf?src-supplier=Element14; Supplier 1: Mouser; Supplier Part Number 1: 71-CRCW0201-10K
R405 R416 = CRCW02014K02FNED: Fixed Resistor, Metal Glaze/thick Film, 0.05W, 4020ohm, 30V, 1% +/-Tol, 200ppm/Cel, Surface Mount, 0201; Manufacturer: Vishay; Medical Grade MFR: Mini-Systems; Medical Grade MFR PN: MWA96SM-4021F-NS62TR; Power: 50mW; Rated Temperature: 70°C; Temperature Coefficient: 200ppm/°C; Package Height: 0.23mm; Package Length: 0.6mm; Package Width: 0.3mm; Reference Standard: AEC-Q200; Category: Chip SMD Resistors; Supplier: Digikey; Supplier Part Number: 541-CRCW02014K02FNEDCT-ND; Manufacturer Part Number: CRCW02014K02FNED; RoHS: Yes; Stock: 14472; Pricing: 1=0,1, 10=0,037, 50=0,0242, 100=0,0204, 500=0,01426, 1000=0,01241, 5000=0,00924 (USD); Mounting Technology: Surface Mount; Pins: 2; Package Shape: Rectangular; Case/Package: 0201; Terminal Finish: Nickel; Min Operating Temperature: -55°C; Max Operating Temperature: 155°C; JESD-609 Code: e3; Resistor Type: FIXED RESISTOR; Construction: Chip; Package Style: SMTMeter; Packaging: Tape and Reel; Technology: METAL GLAZE/THICK FILM; Termination: Wraparound; Working Voltage: 30V; Reach SVHC Compliant: Yes; RoHS Compliant: Yes; ComponentLink1URL: https://datasheet.ciiva.com:443/pdfs/VipMasterIC/IC/VISH/VISH-S-A0002932828/VISH-S-A0002932828-1.pdf?src-supplier=IHS+Markit; ComponentLink1Description: https://datasheet.ciiva.com:443/pdfs/VipMasterIC/IC/VISH/VISH-S-A0002932828/VISH-S-A0002932828-1.pdf?src-supplier=IHS+Markit; ComponentLink2URL: https://datasheet.ciiva.com/7690/1719906-7690620.pdf?src-supplier=Element14; ComponentLink2Description: https://datasheet.ciiva.com/7690/1719906-7690620.pdf?src-supplier=Element14; ComponentLink3URL: https://datasheet.ciiva.com/7690/1719906-7690621.pdf?src-supplier=Element14; ComponentLink3Description: https://datasheet.ciiva.com/7690/1719906-7690621.pdf?src-supplier=Element14; ComponentLink4URL: https://datasheet.ciiva.com/9074/crcw0201e3-9074873.pdf?src-supplier=Avnet; ComponentLink4Description: https://datasheet.ciiva.com/9074/crcw0201e3-9074873.pdf?src-supplier=Avnet; ComponentLink5URL: https://datasheet.ciiva.com/22675/1700795-22675166.pdf?src-supplier=Element14; ComponentLink5Description: https://datasheet.ciiva.com/22675/1700795-22675166.pdf?src-supplier=Element14; Supplier 1: Digikey; Supplier Part Number 1: 541-CRCW02014K02FNEDCT-ND
R406 R417 = CRCW02017K50FNED: Fixed Resistor, Metal Glaze/thick Film, 0.05W, 7500ohm, 30V, 1% +/-Tol, 200ppm/Cel, Surface Mount, 0201; Manufacturer: Vishay; Medical Grade MFR: Mini-Systems; Medical Grade MFR PN: MWA96SM-7501F-NS62TR; Power: 50mW; Rated Temperature: 70°C; Temperature Coefficient: 200ppm/°C; Package Height: 0.23mm; Package Length: 0.6mm; Package Width: 0.3mm; Reference Standard: AEC-Q200; Category: Chip SMD Resistors; Supplier: Digikey; Supplier Part Number: 541-7.50KABCT-ND; Manufacturer Part Number: CRCW02017K50FNED; RoHS: Yes; Stock: 42220; Pricing: 1=0,1, 10=0,037, 50=0,0242, 100=0,0204, 500=0,01426, 1000=0,01241, 5000=0,00924 (USD); Mounting Technology: Surface Mount; Pins: 2; Package Shape: Rectangular; Case/Package: 0201; Terminal Finish: Nickel; Min Operating Temperature: -55°C; Max Operating Temperature: 155°C; JESD-609 Code: e3; Resistor Type: FIXED RESISTOR; Construction: Chip; Package Style: SMTMeter; Packaging: Tape and Reel; Technology: METAL GLAZE/THICK FILM; Termination: Wraparound; Working Voltage: 30V; Reach SVHC Compliant: Yes; RoHS Compliant: Yes; ComponentLink1URL: https://datasheet.ciiva.com:443/pdfs/VipMasterIC/IC/VISH/VISH-S-A0002932828/VISH-S-A0002932828-1.pdf?src-supplier=IHS+Markit; ComponentLink1Description: https://datasheet.ciiva.com:443/pdfs/VipMasterIC/IC/VISH/VISH-S-A0002932828/VISH-S-A0002932828-1.pdf?src-supplier=IHS+Markit; ComponentLink2URL: https://datasheet.ciiva.com/2474/crcw0201e3-2474815.pdf?src-supplier=Digikey; ComponentLink2Description: https://datasheet.ciiva.com/2474/crcw0201e3-2474815.pdf?src-supplier=Digikey; ComponentLink3URL: https://datasheet.ciiva.com/2474/crcw0201e3-2474816.pdf?src-supplier=Digikey; ComponentLink3Description: https://datasheet.ciiva.com/2474/crcw0201e3-2474816.pdf?src-supplier=Digikey; ComponentLink4URL: https://datasheet.ciiva.com/2474/crcw0201e3-2474817.pdf?src-supplier=Digikey; ComponentLink4Description: https://datasheet.ciiva.com/2474/crcw0201e3-2474817.pdf?src-supplier=Digikey; ComponentLink5URL: https://datasheet.ciiva.com/9058/crcw0201e3-9058555.pdf?src-supplier=Avnet; ComponentLink5Description: https://datasheet.ciiva.com/9058/crcw0201e3-9058555.pdf?src-supplier=Avnet; ComponentLink6URL: https://datasheet.ciiva.com/7679/1719906-7679036.pdf?src-supplier=Element14; ComponentLink6Description: https://datasheet.ciiva.com/7679/1719906-7679036.pdf?src-supplier=Element14; ComponentLink7URL: https://datasheet.ciiva.com/7679/1719906-7679037.pdf?src-supplier=Element14; ComponentLink7Description: https://datasheet.ciiva.com/7679/1719906-7679037.pdf?src-supplier=Element14; ComponentLink8URL: https://datasheet.ciiva.com/22704/1719906-22704599.pdf?src-supplier=Element14; ComponentLink8Description: https://datasheet.ciiva.com/22704/1719906-22704599.pdf?src-supplier=Element14; Supplier 1: Digikey; Supplier Part Number 1: 541-7.50KABCT-ND
R407 R419 = MCS0402MD6193BE000: Resistor, 619k, 0.1%, 0402; Manufacturer: Vishay; Medical Grade MFR: TBD; Length (mm): 1.12 ±0.10; Medical Grade MFR PN: TBD; PCB Footprint: res0402_reduced; Thickness (mm): 0.33 ±0.08; Width (mm): 0.56 ±0.08; Category: Resistor; Supplier 1: Digi-Key; Supplier Part Number 1: 541-MCS0402MD6193BE000CT-ND; Status: *; Review: *; Manufacturer Part Number: MCS0402MD6193BE000
R409 R420 = RP73PF1E243KBTD: Resistor, 243k, 0.1%, 0402; Manufacturer: TE Connectivity; Medical Grade MFR: TBD; Manufacturer Part Number: RP73PF1E243KBTDF; Review: 020823; Length (mm): 1.12 ±0.10; Medical Grade MFR PN: TBD; PCB Footprint: res0402_reduced; Thickness (mm): 0.33 ±0.08; Width (mm): 0.56 ±0.08; Category: Resistor; Supplier 1: Digikey; Supplier Part Number 1: A127548CT-ND; Status: Approved
R418 = CRCW02015M10FNED: Fixed Resistor, Metal Glaze/thick Film, 0.05W, 5100000ohm, 30V, 1% +/-Tol, 200ppm/Cel, Surface Mount, 0201; Manufacturer: Vishay Draloric; Manufacturer Series: CRCW0201E3; Medical Grade MFR: TBD; Power: 50mW; Rated Temperature: 70°C; Temperature Coefficient: 200ppm/°C; Supplier: Digikey; Supplier Part Number: 541-CRCW02015M10FNEDCT-ND; Manufacturer Part Number: CRCW02015M10FNED; RoHS: Yes; Category: Chip SMD Resistors; Stock: 56300; Pricing: 1=0,1, 10=0,037, 50=0,0242, 100=0,0204, 500=0,01426, 1000=0,01241, 5000=0,00924 (USD); Mounting Technology: Surface Mount; Pins: 2; Package Shape: Rectangular; Case/Package: 0201; Terminal Finish: Nickel; Min Operating Temperature: -55°C; Max Operating Temperature: 155°C; JESD-609 Code: e3; Resistor Type: FIXED RESISTOR; Packaging: Tape and Reel; Technology: METAL GLAZE/THICK FILM; Termination: Wraparound; Working Voltage: 30V; Reach SVHC Compliant: Yes; RoHS Compliant: Yes; ComponentLink1URL: https://datasheet.ciiva.com:443/pdfs/VipMasterIC/IC/VISH/VISH-S-A0002932828/VISH-S-A0002932828-1.pdf?src-supplier=IHS+Markit; ComponentLink1Description: https://datasheet.ciiva.com:443/pdfs/VipMasterIC/IC/VISH/VISH-S-A0002932828/VISH-S-A0002932828-1.pdf?src-supplier=IHS+Markit; ComponentLink2URL: https://datasheet.ciiva.com/7843/1719906-7843192.pdf?src-supplier=Element14; ComponentLink2Description: https://datasheet.ciiva.com/7843/1719906-7843192.pdf?src-supplier=Element14; ComponentLink3URL: https://datasheet.ciiva.com/7843/1719906-7843193.pdf?src-supplier=Element14; ComponentLink3Description: https://datasheet.ciiva.com/7843/1719906-7843193.pdf?src-supplier=Element14; ComponentLink4URL: https://datasheet.ciiva.com/6073/1719906-6073775.pdf?src-supplier=Farnell; ComponentLink4Description: https://datasheet.ciiva.com/6073/1719906-6073775.pdf?src-supplier=Farnell; Medical Grade MFR PN: TBD; Supplier 1: Digikey; Supplier Part Number 1: 541-CRCW02015M10FNEDCT-ND
R429 R430 = CRCW02010000Z0ED: Fixed Resistor, Metal Glaze/thick Film, 0.05W, 0ohm, Surface Mount, 0201; Manufacturer: Vishay; Medical Grade MFR: Mini-Systems; Medical Grade MFR PN: MWA96SM-0000F-NS62TR; Power: 50mW; Rated Temperature: 70°C; Package Height: 0.23mm; Package Length: 0.6mm; Package Width: 0.3mm; Reference Standard: AEC-Q200; Category: Chip SMD Resistors; Supplier: Digikey; Supplier Part Number: 541-0.0AGCT-ND; Manufacturer Part Number: CRCW02010000Z0ED; RoHS: Yes; Stock: 701366; Pricing: 1=0,1, 10=0,034, 25=0,026, 50=0,0198, 100=0,0138, 250=0,01112, 500=0,0089, 1000=0,00655, 5000=0,0047 (USD); Mounting Technology: Surface Mount; Pins: 2; Package Shape: Rectangular; Case/Package: 0201; Terminal Finish: Nickel; Min Operating Temperature: -55°C; Max Operating Temperature: 155°C; JESD-609 Code: e3; Resistor Type: FIXED RESISTOR; Construction: Chip; Package Style: SMTMeter; Packaging: Tape and Reel; Technology: METAL GLAZE/THICK FILM; Termination: Wraparound; Reach SVHC Compliant: Yes; RoHS Compliant: Yes; ComponentLink1URL: https://datasheet.ciiva.com:443/pdfs/VipMasterIC/IC/VISH/VISH-S-A0002932828/VISH-S-A0002932828-1.pdf?src-supplier=IHS+Markit; ComponentLink1Description: https://datasheet.ciiva.com:443/pdfs/VipMasterIC/IC/VISH/VISH-S-A0002932828/VISH-S-A0002932828-1.pdf?src-supplier=IHS+Markit; ComponentLink2URL: https://datasheet.ciiva.com/2471/crcw0201e3-2471712.pdf?src-supplier=Digikey; ComponentLink2Description: https://datasheet.ciiva.com/2471/crcw0201e3-2471712.pdf?src-supplier=Digikey; ComponentLink3URL: https://datasheet.ciiva.com/7841/1719906-7841431.pdf?src-supplier=Element14; ComponentLink3Description: https://datasheet.ciiva.com/7841/1719906-7841431.pdf?src-supplier=Element14; ComponentLink4URL: https://datasheet.ciiva.com/7841/1719906-7841430.pdf?src-supplier=Element14; ComponentLink4Description: https://datasheet.ciiva.com/7841/1719906-7841430.pdf?src-supplier=Element14; ComponentLink5URL: https://datasheet.ciiva.com/22665/1847332-22665688.pdf?src-supplier=Element14; ComponentLink5Description: https://datasheet.ciiva.com/22665/1847332-22665688.pdf?src-supplier=Element14; ComponentLink6URL: https://datasheet.ciiva.com/2471/crcw0201e3-2471713.pdf?src-supplier=Digikey; ComponentLink6Description: https://datasheet.ciiva.com/2471/crcw0201e3-2471713.pdf?src-supplier=Digikey; ComponentLink7URL: https://datasheet.ciiva.com/2471/crcw0201e3-2471711.pdf?src-supplier=Digikey; ComponentLink7Description: https://datasheet.ciiva.com/2471/crcw0201e3-2471711.pdf?src-supplier=Digikey; ComponentLink8URL: https://datasheet.ciiva.com/16757/70202042-16757849.pdf?src-supplier=Allied+Electronics; ComponentLink8Description: https://datasheet.ciiva.com/16757/70202042-16757849.pdf?src-supplier=Allied+Electronics; ComponentLink9URL: https://datasheet.ciiva.com/16436/crcw0201e3-16436237.pdf?src-supplier=Future+Electronics; ComponentLink9Description: https://datasheet.ciiva.com/16436/crcw0201e3-16436237.pdf?src-supplier=Future+Electronics; Supplier 1: Digikey; Supplier Part Number 1: 541-0.0AGDKR-ND
TP400-TP435 = Test Point: Test pad, 0.90mm circular pad; PCB Footprint: testpad_0p90mm; Length (mm): 0.90; Manufacturer: N/A; Manufacturer PN: N/A; Medical Grade MFR: N/A; Medical Grade MFR PN: N/A; Rating: N/A; Thickness (mm): N/A; Value: Test point; Width (mm): 0.90; Category: Test point; Status: *; Review: *
U400 U402 = LTC4065LEDC#TRPBF: Charge Controller, 4.2V, 250mA, DFN-6; Medical Grade MFR: TBD; Category: IC; Length (mm): 2.00 ±0.10; Medical Grade MFR PN: TBD; PCB Footprint: TBD; Rating: 250mA; Thickness (mm): 0.75 ±0.05; Width (mm): 2.00 ±0.10; Alt Manufacturer: -; Alt Manufacturer PN: -; Supplier 1: Digi-Key; Supplier Part Number 1: 505-LTC4065LEDC#TRPBFCT-ND; Supplier Link: https://www.analog.com/en/products/ltc4065l.html; Datasheet: https://datasheet.ciiva.com/pdfs/VipMasterIC/IC/ANDI/ANDI-S-A0006647666/ANDI-S-A0006647666-1.pdf?src-supplier=IHS+Markit; Status: *; Review: *; Manufacturer Part Number: LTC4065LEDC#TRPBF
U401 U403 = TLV4021R1YKAR: Comparator, 1.2V Reference, Open-drain, BGA-4; Medical Grade MFR: TBD; Category: IC; Length (mm): 0.73 ±0.03; Medical Grade MFR PN: TBD; Package Description: TBD; PCB Footprint: TBD; Rating: TBD; Thickness (mm): 0.40; Supplier 1: Digi-Key; Supplier Part Number 1: 296-TLV4021R1YKARCT-ND; Status: *; Review: *; Manufacturer Part Number: TLV4021R1YKAR; Value: TLV4021R1YKAR
U404 U405 = AD8505ACBZ-R7: Op Amp, Rail-to-Rail, 95kHz, WLCSP-6; Medical Grade MFR: TBD; Rating: 5.5V; Category: IC; Length (mm): 1.39 ±0.04; Medical Grade MFR PN: TBD; PCB Footprint: TBD; Thickness (mm): 0.56 ±0.05; Width (mm): 0.90 ±0.04; Package Description: TBD; Supplier 1: Digi-Key; Supplier Part Number 1: AD8505ACBZ-R7CT-ND; Status: *; Review: *; Manufacturer Part Number: AD8505ACBZ-R7; Value: AD8505ACBZ-R7